# EAGLE design CSC4863 (EAGLE 7.1.0)
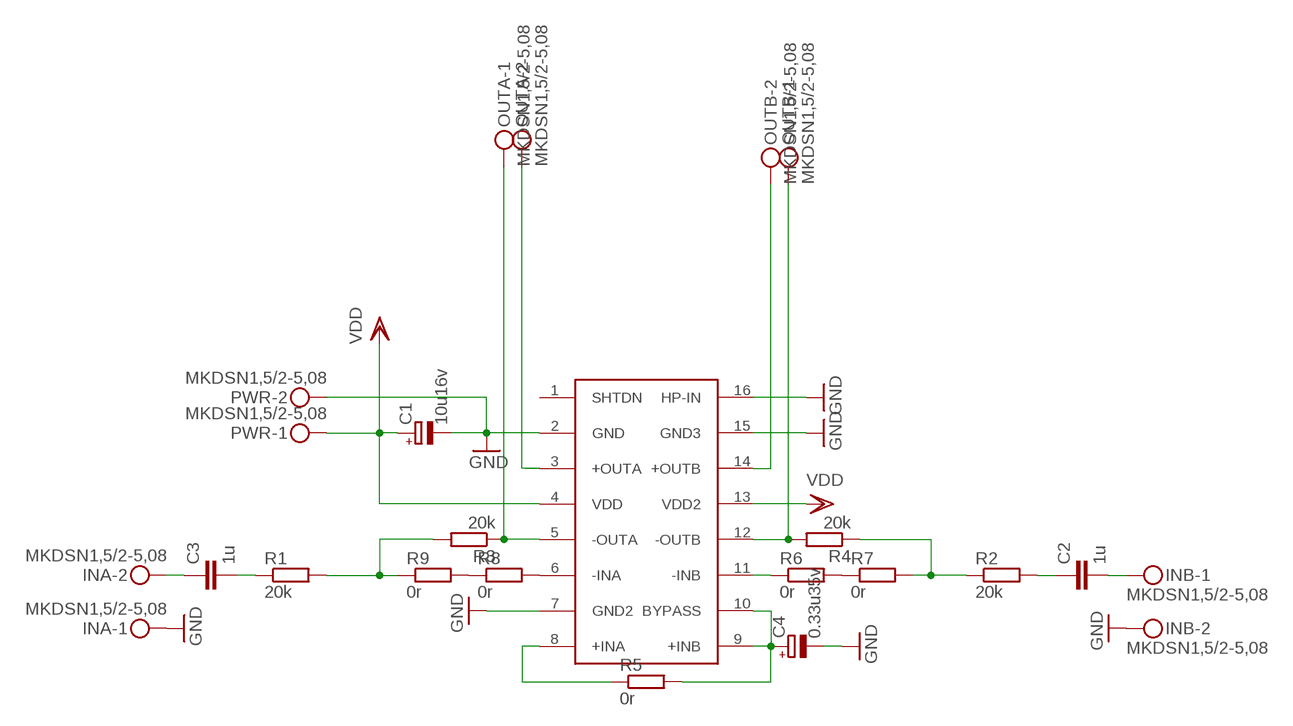
[diagram p0: schematic, sheet 1]

## Parts
C1  10u16v  CPOL-EUSMCA  [SMC_A]
C2  1u  C-EUC1206  [C1206]
C3  1u  C-EUC1206  [C1206]
C4  0.33u35v  CPOL-EUSMCA  [SMC_A]
INA  MKDSN1,5/2-5,08  [MKDSN1,5/2-5,08]
INB  MKDSN1,5/2-5,08  [MKDSN1,5/2-5,08]
OUTA  MKDSN1,5/2-5,08  [MKDSN1,5/2-5,08]
OUTB  MKDSN1,5/2-5,08  [MKDSN1,5/2-5,08]
PWR  MKDSN1,5/2-5,08  [MKDSN1,5/2-5,08]
R1  20k  R-EU_R1206  [R1206]
R2  20k  R-EU_R1206  [R1206]
R3  20k  R-EU_R1206  [R1206]
R4  20k  R-EU_R1206  [R1206]
R5  0r  R-EU_R1206  [R1206]
R6  0r  R-EU_R1206  [R1206]
R7  0r  R-EU_R1206  [R1206]
R8  0r  R-EU_R1206  [R1206]
R9  0r  R-EU_R1206  [R1206]
U$1  CSC4863  [SO16]

## Nets
GND: C1.- C4.- INA.1 INB.2 PWR.2 U$1.2(GND) U$1.7(GND2) U$1.15(GND3) U$1.16(HP-IN)
N$1: C2.2 INB.1
N$2: C3.1 INA.2
N$3: C3.2 R1.1
N$4: C2.1 R2.2
N$5: R1.2 R3.2 R9.1
N$6: R2.1 R4.1 R7.2
N$7: C4.+ R5.2 U$1.9(+INB) U$1.10(BYPASS)
N$8: OUTA.2 U$1.3(+OUTA)
N$9: OUTA.1 R3.1 U$1.5(-OUTA)
N$10: OUTB.2 U$1.14(+OUTB)
N$11: OUTB.1 R4.2 U$1.12(-OUTB)
N$12: R5.1 U$1.8(+INA)
N$13: R6.1 U$1.11(-INB)
N$14: R6.2 R7.1
N$15: R8.2 U$1.6(-INA)
N$16: R8.1 R9.2
VDD: C1.+ PWR.1 U$1.4(VDD) U$1.13(VDD2)
Unconnected: U$1.1(SHTDN)

## Library data of the parts
C1 C4 = rcl:CPOL-EU: POLARIZED CAPACITOR, European symbol
C2 C3 = rcl:C-EU: CAPACITOR, European symbol
INA INB OUTA OUTB PWR = con-phoenix-508:MKDSN1,5/2-5,08: MKDSN 1,5/ 2-5,08 Printklemme Nennstrom: 13,5 A Nennspannung: 250 V Rastermaß: 5,08 mm Polzahl: 2 Anschlussart: Schraubanschluss Montage: Löten Anschlussrichtung Leiter/Platine: 0 ° Artikelnummer: 1729128 Source: http://eshop.phoenixcontact.com .. 1729128.pdf
R1-R9 = rcl:R-EU_: RESISTOR, European symbol
U$1 = Namenlos:CSC4863

## Board
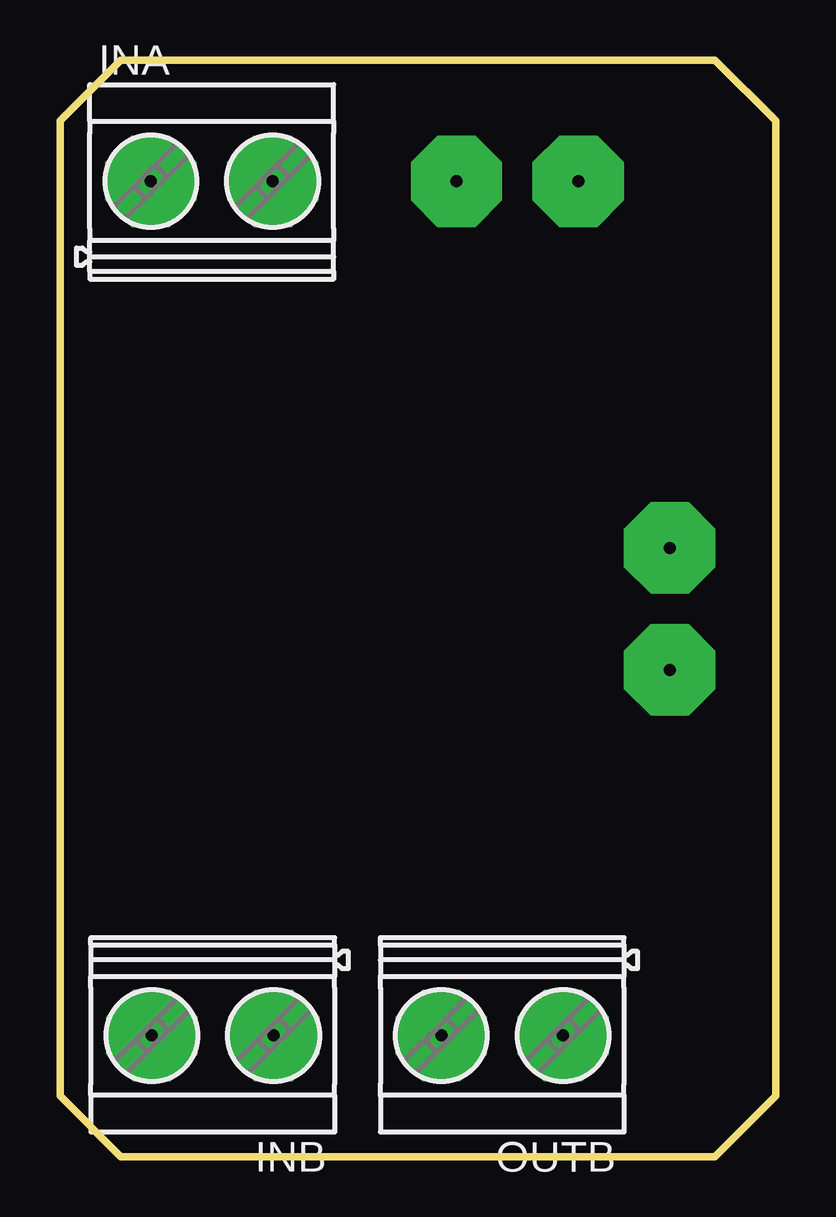
[diagram p1: board, top side]
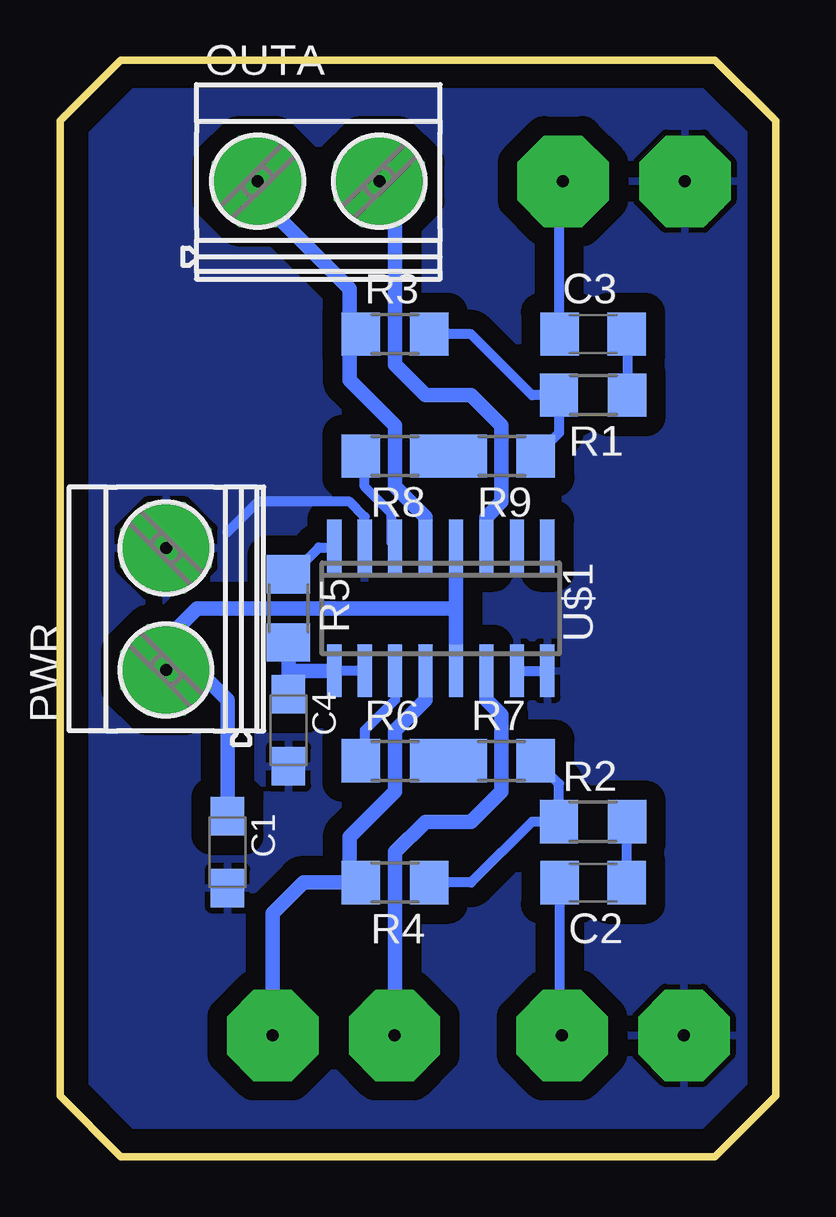
[diagram p2: board, bottom side, seen from below]

Size 29.84 x 45.72 mm. Coordinates in mm from the lower left corner, seen from the top.
Outline: 27.3,0 2.54,0 0,2.54 0,43.18 2.54,45.72 27.3,45.72 29.84,43.18 29.84,2.54 27.3,0
Copper layers (1*16): Top 0.035mm / dielectric 1.5mm / Bottom 0.035mm
Design rules "default": minimum track width 10mil, minimum drill 24mil, track to track 8mil, track to pad 8mil, pad to pad 8mil, via to via 8mil, smd to smd 8mil, copper to edge 40mil, drill to drill 8mil, minimum pad ring 10mil, minimum via ring 8mil, stop-mask expansion 4mil, vias tented up to drill 0mil, thermal gap 10mil

### Footprints (pad centres in the part's own frame; a part is rotated, then mirrored left to right if it is on the bottom)
SMC_A = smd 1.6 x 1.4: + -1.5,0; - 1.5,0
C1206 = smd 1.6 x 1.8: 1 -1.4,0; 2 1.4,0
MKDSN1,5/2-5,08 = drill 0.5 pad 3.81 octagon: 1 -2.561,0.025; 2 2.519,0.025
R1206 = smd 1.6 x 1.803: 1 -1.422,0; 2 1.422,0
SO16 = smd 0.6 x 2.2: 1 -4.445,-2.6; 2 -3.175,-2.6; 3 -1.905,-2.6; 4 -0.635,-2.6; 5 0.635,-2.6; 6 1.905,-2.6; 7 3.175,-2.6; 8 4.445,-2.6; 9 4.445,2.6; 10 3.175,2.6; 11 1.905,2.6; 12 0.635,2.6; 13 -0.635,2.6; 14 -1.905,2.6; 15 -3.175,2.6; 16 -4.445,2.6

### Placement (x,y rotation side)
C1  22.86,12.7 270 bottom
C2  7.62,11.43 180 bottom
C3  7.62,34.29 0 bottom
C4  20.32,17.78 270 bottom
INA  6.35,40.64 0 top
INB  6.35,5.08 180 top
OUTA  19.05,40.64 0 bottom
OUTB  18.41,5.08 180 top
PWR  25.4,22.86 90 bottom
R1  7.62,31.75 180 bottom
R2  7.62,13.97 0 bottom
R3  15.88,34.29 0 bottom
R4  15.88,11.43 180 bottom
R5  20.32,22.86 270 bottom
R6  15.88,16.51 0 bottom
R7  11.43,16.51 0 bottom
R8  15.88,29.21 180 bottom
R9  11.43,29.21 180 bottom
U$1  13.97,22.86 180 bottom

### Tracks (layer width: path | path; a pad name or v marks a point on that pad's centre or on a via)
GND
  Bottom 0.406: U$1.15 U$1.16 | 22.86,26.04 21.59,27.3 17.78,27.3 17.14,26.67 U$1.7
  pour Bottom (isolate 0.813): 2.54,0 0,2.54 0,43.18 2.54,45.72 27.3,45.72 29.84,43.18 29.84,2.54 27.3,0
N$1
  Bottom 0.406: C2.2 9.02,5.16 INB.1
N$2
  Bottom 0.406: C3.1 9.02,40.51 INA.2
N$3
  Bottom 0.406: C3.2 6.2,34.16 R1.1
N$4
  Bottom 0.406: C2.1 6.22,13.95 R2.2
N$5
  Bottom 0.406: R9.1 9.04,30.18 R1.2 10.16,31.75 12.7,34.29 R3.2
N$6
  Bottom 0.406: R7.2 9.04,15.54 R2.1 10.16,13.97 12.7,11.43 R4.1
N$7
  Bottom 0.406: U$1.10 U$1.9
  Bottom 0.61: U$1.9 20.26,20.26 20.32,20.32 | 20.32,20.32 C4.+ | R5.2 20.32,21.59 20.32,20.32
N$8
  Bottom 0.61: U$1.3 12.06,26.67 11.43,27.3 11.43,30.48 12.7,31.75 14.61,31.75 15.88,33.02 15.88,40.01 OUTA.2
N$9
  Bottom 0.406: 17.78,34.44 R3.1 17.78,34.14
  Bottom 0.61: OUTA.1 21.61,40.03 17.78,36.2 17.78,34.44 | 17.78,34.14 17.78,32.39 15.88,30.48 15.88,27.94 14.61,26.67 U$1.5
N$10
  Bottom 0.406: 15.88,5.08 OUTB.2
  Bottom 0.61: U$1.14 12.06,19.05 11.43,18.41 11.43,15.24 12.7,13.97 14.61,13.97 15.88,12.7 15.88,5.08
N$11
  Bottom 0.406: 17.78,11.91 R4.2
  Bottom 0.61: OUTB.1 20.98,10.14 19.68,11.43 R4.2 | 17.78,11.91 17.78,13.33 15.88,15.24 15.88,17.78 15.24,18.41 14.61,19.05 U$1.12
N$12
  Bottom 0.406: R5.1 20.17,24.28 19.05,25.4 18.48,25.4 U$1.8
N$13
  Bottom 0.406: R6.1 17.78,16.51 17.14,17.14 17.14,17.78 15.88,19.05 U$1.11
N$14
  Bottom 0.406: R7.1 R6.2
N$15
  Bottom 0.406: U$1.6 16.03,25.61 16.03,26.82 17.14,27.94 17.14,29.06 R8.2
N$16
  Bottom 0.406: R9.2 R8.1
VDD
  Bottom 0.61: U$1.4 13.34,22.86 | 13.34,22.86 U$1.13 13.34,22.86 | 13.34,22.86 24.13,22.86 25.4,21.59 25.4,20.32 PWR.1 25.4,20.32 24.13,20.32 22.86,19.05 C1.+